# Altium schematic sheet KegMaster_Satellite_Schematic_Altium_Format.schdoc
size 313 x 218 mm
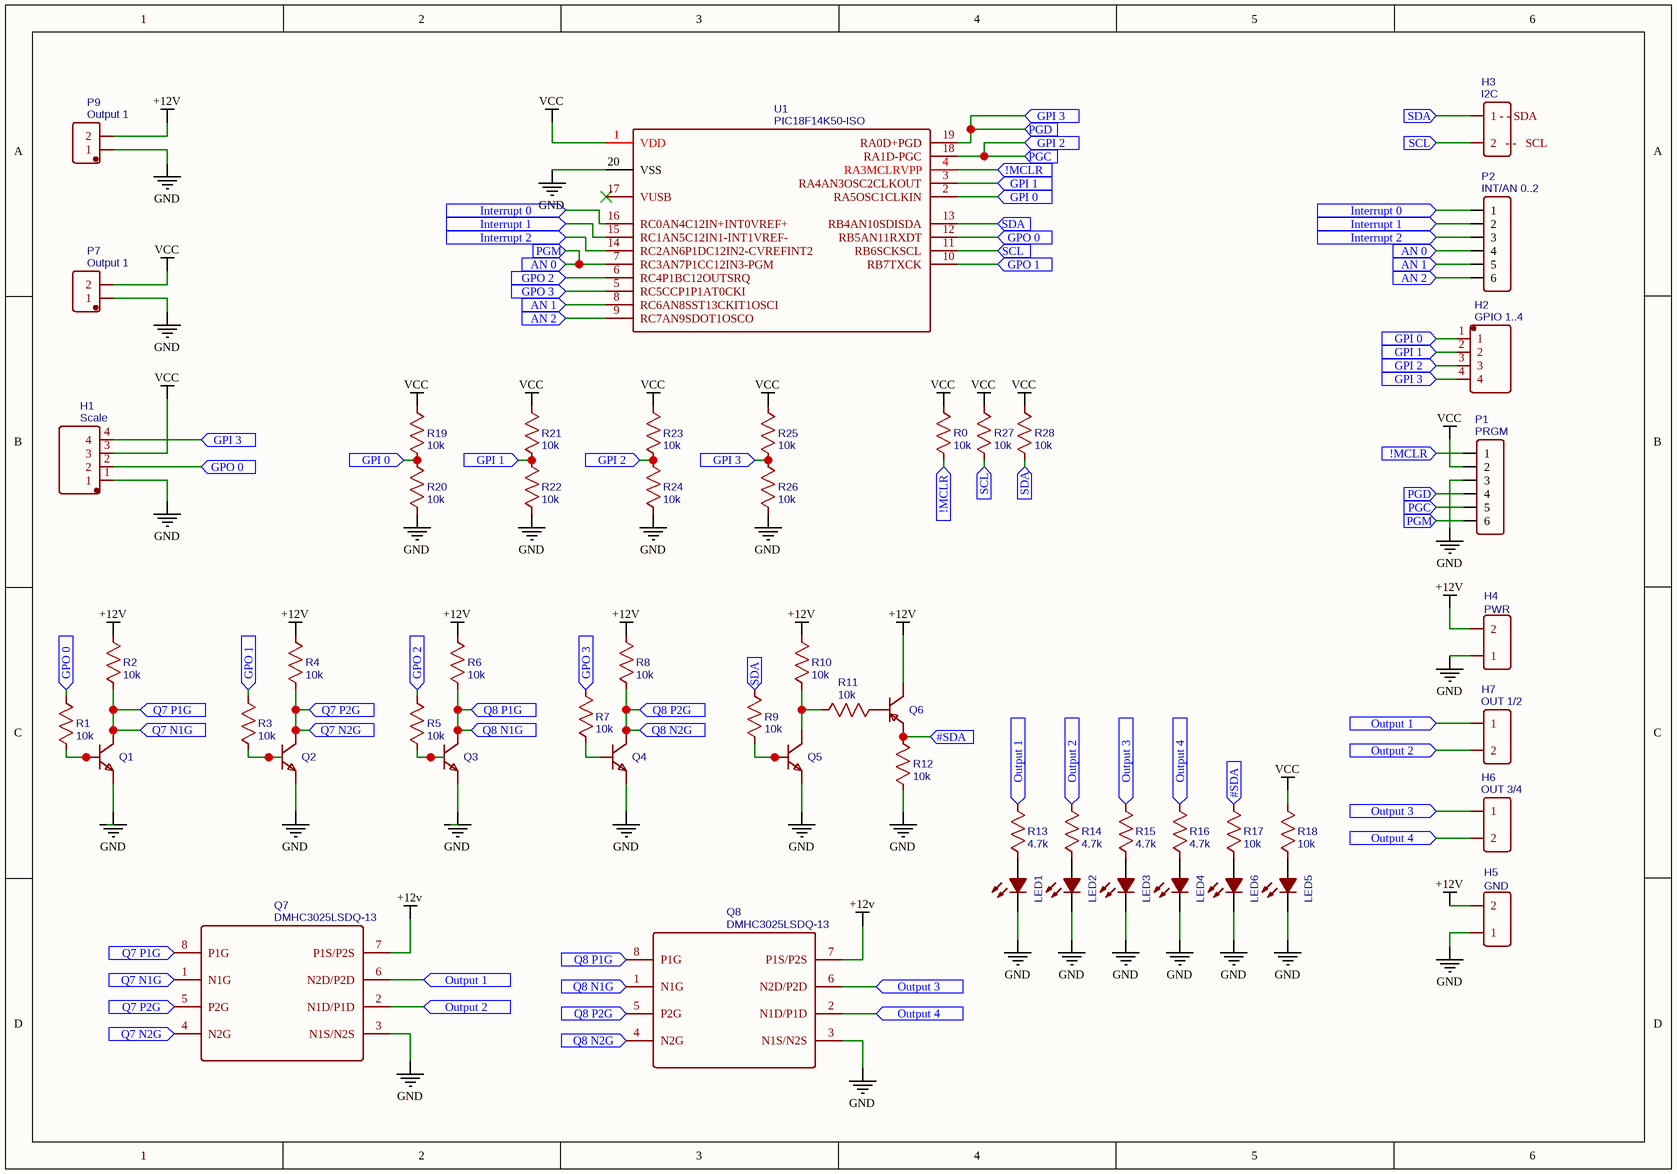
[diagram p0: KegMaster_Satellite_Schematic_Altium_Format.schdoc]

## Parts
H1  Scale  [DIP-1X4P-2.54MM-M]
H2  GPIO 1..4  [DIP-1X4P-2.54MM-M]
H3  I2C  [HDR-2X1/2.54]
H4  PWR  [HDR-2X1/2.54]
H5  GND  [HDR-2X1/2.54]
H6  OUT 3/4  [HDR-2X1/2.54]
H7  OUT 1/2  [HDR-2X1/2.54]
LED1  17-21/BHC-XL2M2TY/3T  [LED0805-RD]  (value not drawn)
LED2  17-21/BHC-XL2M2TY/3T  [LED0805-RD]  (value not drawn)
LED3  17-21/BHC-XL2M2TY/3T  [LED0805-RD]  (value not drawn)
LED4  17-21/BHC-XL2M2TY/3T  [LED0805-RD]  (value not drawn)
LED5  17-21/BHC-XL2M2TY/3T  [LED0805-RD]  (value not drawn)
LED6  17-21/BHC-XL2M2TY/3T  [LED0805-RD]  (value not drawn)
P1  PRGM  [HDR-6X1/2.54]
P2  INT/AN 0..2  [HDR-6X1/2.54]
P7  Output 1  [WJ2EDGVC-5.08-2P]
P9  Output 1  [WJ2EDGVC-5.08-2P]
Q1  BC846BLT1G  [SOT-23(SOT-23-3)]  (value not drawn)
Q2  BC846BLT1G  [SOT-23(SOT-23-3)]  (value not drawn)
Q3  BC846BLT1G  [SOT-23(SOT-23-3)]  (value not drawn)
Q4  BC846BLT1G  [SOT-23(SOT-23-3)]  (value not drawn)
Q5  BC846BLT1G  [SOT-23(SOT-23-3)]  (value not drawn)
Q6  MMBT5401  [SOT-23(SOT-23-3)]  (value not drawn)
Q7  DMHC3025LSDQ-13  [SO-8_4.4MM]
Q8  DMHC3025LSDQ-13  [SO-8_4.4MM]
R0  10k  [0805]
R1  10k  [0805]
R2  10k  [0805]
R3  10k  [0805]
R4  10k  [0805]
R5  10k  [0805]
R6  10k  [0805]
R7  10k  [0805]
R8  10k  [0805]
R9  10k  [0805]
R10  10k  [0805]
R11  10k  [0805]
R12  10k  [0805]
R13  4.7k  [0805]
R14  4.7k  [0805]
R15  4.7k  [0805]
R16  4.7k  [0805]
R17  10k  [0805]
R18  10k  [0805]
R19  10k  [0805]
R20  10k  [0805]
R21  10k  [0805]
R22  10k  [0805]
R23  10k  [0805]
R24  10k  [0805]
R25  10k  [0805]
R26  10k  [0805]
R27  10k  [0805]
R28  10k  [0805]
U1  PIC18F14K50-ISO  [SOIC20]

## Ports
!MCLR, #SDA, AN 0, AN 1, AN 2, GPI 0, GPI 1, GPI 2, GPI 3, GPO 0, GPO 1, GPO 2, GPO 3, Interrupt 0, Interrupt 1, Interrupt 2, Output 1, Output 2, Output 3, Output 4, PGC, PGD, PGM, Q7 N1G, Q7 N2G, Q7 P1G, Q7 P2G, Q8 N1G, Q8 N2G, Q8 P1G, Q8 P2G, SCL, SDA

## Nets
+12v: H4.2 H5.2 P9.2 Q6.3(C) Q7.7(P1S/P2S) Q8.7(P1S/P2S) R2.2 R4.2 R6.2 R8.2 R10.2
GND: H1.1 H4.1 H5.1 LED1.1(-) LED2.1(-) LED3.1(-) LED4.1(-) LED5.1(-) LED6.1(-) P1.3 P7.1 P9.1 Q1.2(E) Q2.2(E) Q3.2(E) Q4.2(E) Q5.2(E) Q7.3(N1S/N2S) Q8.3(N1S/N2S) R12.1 R20.1 R22.1 R24.1 R26.1 U1.20(VSS)
VCC: H1.3 P1.2 P7.2 R0.2 R18.1 R19.1 R21.1 R23.1 R25.1 R27.2 R28.2 U1.1(VDD)
!MCLR: P1.1 R0.1 U1.4(RA3MCLRVPP) ; port !MCLR
#SDA: Q6.2(E) R12.2 R17.1 ; port #SDA
AN 0: P1.6 P2.4 U1.7(RC3AN7P1CC12IN3-PGM) ; port AN 0, port PGM
AN 1: P2.5 U1.8(RC6AN8SST13CKIT1OSCI) ; port AN 1
AN 2: P2.6 U1.9(RC7AN9SDOT1OSCO) ; port AN 2
GPI 0: H2.1 R19.2 R20.2 U1.2(RA5OSC1CLKIN) ; port GPI 0
GPI 1: H2.2 R21.2 R22.2 U1.3(RA4AN3OSC2CLKOUT) ; port GPI 1
GPI 2: H2.3 P1.5 R23.2 R24.2 U1.18(RA1D-PGC) ; port GPI 2, port PGC
GPI 3: H1.4 H2.4 P1.4 R25.2 R26.2 U1.19(RA0D+PGD) ; port GPI 3, port PGD
GPO 0: H1.2 R1.1 U1.12(RB5AN11RXDT) ; port GPO 0
GPO 1: R3.1 U1.10(RB7TXCK) ; port GPO 1
GPO 2: R5.1 U1.6(RC4P1BC12OUTSRQ) ; port GPO 2
GPO 3: R7.1 U1.5(RC5CCP1P1AT0CKI) ; port GPO 3
Interrupt 0: P2.1 U1.16(RC0AN4C12IN+INT0VREF+) ; port Interrupt 0
Interrupt 1: P2.2 U1.15(RC1AN5C12IN1-INT1VREF-) ; port Interrupt 1
Interrupt 2: P2.3 U1.14(RC2AN6P1DC12IN2-CVREFINT2) ; port Interrupt 2
Output 1: H7.1 Q7.6(N2D/P2D) R13.1 ; port Output 1
Output 2: H7.2 Q7.2(N1D/P1D) R14.1 ; port Output 2
Output 3: H6.1 Q8.6(N2D/P2D) R15.1 ; port Output 3
Output 4: H6.2 Q8.2(N1D/P1D) R16.1 ; port Output 4
Q7 N1G: Q1.3(C) Q7.1(N1G) Q7.8(P1G) R2.1 ; port Q7 P1G, port Q7 N1G
Q7 N2G: Q2.3(C) Q7.4(N2G) Q7.5(P2G) R4.1 ; port Q7 N2G, port Q7 P2G
Q8 N1G: Q3.3(C) Q8.1(N1G) Q8.8(P1G) R6.1 ; port Q8 P1G, port Q8 N1G
Q8 N2G: Q4.3(C) Q8.4(N2G) Q8.5(P2G) R8.1 ; port Q8 P2G, port Q8 N2G
SCL: H3.2(2___-_-___SCL) R27.1 U1.11(RB6SCKSCL) ; port SCL
SDA: H3.1(1_-_-_SDA) R9.1 R28.1 U1.13(RB4AN10SDISDA) ; port SDA
NetLED1_2: LED1.2(+) R13.2
NetLED2_2: LED2.2(+) R14.2
NetLED3_2: LED3.2(+) R15.2
NetLED4_2: LED4.2(+) R16.2
NetLED5_2: LED5.2(+) R18.2
NetLED6_2: LED6.2(+) R17.2
NetQ1_1: Q1.1(B) R1.2
NetQ2_1: Q2.1(B) R3.2
NetQ3_1: Q3.1(B) R5.2
NetQ4_1: Q4.1(B) R7.2
NetQ5_1: Q5.1(B) R9.2
NetQ5_3: Q5.3(C) R10.1 R11.1
NetQ6_1: Q6.1(B) R11.2

Not connected (* = marked no-connect by the designer): U1 17(VUSB)*

## Library data of the parts
H1 = Scale: BOM_Manufacturer: Ckmtw; BOM_Manufacturer Part: 210S-1*4P L=11.6MMGold-plated black; Contributor: LCSC; BOM_Supplier: LCSC; BOM_Supplier Part: C124378; spicePre: H
H2 = GPIO 1..4: BOM_Manufacturer: Ckmtw; BOM_Manufacturer Part: 210S-1*4P L=11.6MMGold-plated black; Contributor: LCSC; BOM_Supplier: LCSC; BOM_Supplier Part: C124378; spicePre: H
H3 = I2C: BOM_Manufacturer: TE Connectivity; BOM_Manufacturer Part: 826629-2; BOM_Supplier: LCSC; image: //image.lceda.cn/szlcsc/C86471.jpg; BOM_Supplier Part: C86471; spicePre: H
H4 = PWR: BOM_Manufacturer: TE Connectivity; BOM_Manufacturer Part: 826629-2; BOM_Supplier: LCSC; image: //image.lceda.cn/szlcsc/C86471.jpg; BOM_Supplier Part: C86471; spicePre: H
H5 = GND: BOM_Manufacturer: TE Connectivity; BOM_Manufacturer Part: 826629-2; BOM_Supplier: LCSC; image: //image.lceda.cn/szlcsc/C86471.jpg; BOM_Supplier Part: C86471; spicePre: H
H6 = OUT 3/4: BOM_Manufacturer: TE Connectivity; BOM_Manufacturer Part: 826629-2; BOM_Supplier: LCSC; image: //image.lceda.cn/szlcsc/C86471.jpg; BOM_Supplier Part: C86471; spicePre: H
H7 = OUT 1/2: BOM_Manufacturer: TE Connectivity; BOM_Manufacturer Part: 826629-2; BOM_Supplier: LCSC; image: //image.lceda.cn/szlcsc/C86471.jpg; BOM_Supplier Part: C86471; spicePre: H
LED1-LED6 = 17-21/BHC-XL2M2TY/3T: BOM_Manufacturer: Inolux; BOM_Manufacturer Part: 743-IN-S85AT5B; SMT Type: Extend; BOM_Supplier: LCSC; image: //image.lceda.cn/szlcsc/C72035.jpg; BOM_Supplier Part: IN-S85AT5B; BOM_LCSC Assembly: Yes; spicePre: L
P1 = PRGM: BOM_Manufacturer: BOOMELE; BOM_Manufacturer Part: Header-Male-2.54_1x6; BOM_Supplier: LCSC; BOM_Supplier Part: C37208; spicePre: P
P2 = INT/AN 0..2: BOM_Manufacturer: BOOMELE; BOM_Manufacturer Part: Header-Male-2.54_1x6; BOM_Supplier: LCSC; BOM_Supplier Part: C37208; spicePre: P
P7 P9 = Output 1: BOM_Manufacturer: ReliaPro; spicePre: X; BOM_Supplier: LCSC; BOM_Manufacturer Part: WJ2EDGVC-5.08-2P; image: //image.lceda.cn/szlcsc/C8445.jpg; BOM_Supplier Part: C8445
Q1-Q5 = BC846BLT1G: BOM_Manufacturer: CJ; BOM_Manufacturer Part: On Semi; SMT Type: Extend; BOM_Supplier: Mouser; image: //image.lceda.cn/szlcsc/C28088.jpg; BOM_Supplier Part: BC846BLT1G; BOM_LCSC Assembly: Yes; spicePre: Q
Q6 = MMBT5401: BOM_Manufacturer: ON Semi; BOM_Manufacturer Part: BC846BLT1G; SMT Type: Basic; BOM_Supplier: Mouser; BOM_LCSC Assembly: Yes; image: //image.lceda.cn/szlcsc/C8326.jpg; BOM_Supplier Part: BC856BLT1G; spicePre: Q
Q7 Q8 = DMHC3025LSDQ-13: BOM_Manufacturer: Diodes Incorporated; BOM_Manufacturer Part: DMHC3025LSD-13; Contributor: Munkh; SMT Type: Extend; BOM_Supplier: LCSC; BOM_Supplier Part: C156387; BOM_LCSC Assembly: Yes; spicePre: Q
R0-R12 R17-R28 = 10k: nameAlias: Value(Ω); spicePre: R; spiceSymbolName: Res_0805(1/8W)_US
R13-R16 = 4.7k: nameAlias: Value(Ω); spicePre: R; spiceSymbolName: Res_0805(1/8W)_US
U1 = PIC18F14K50-ISO: description: USB Flash Microcontroller with nanoWatt XLP Technology, 20-pin SOIC, Industrial Temperature; sourceId: u7CBqoJ7W; timeStamp: 1458633385; spicePre: U